# EAGLE design testduino (EAGLE 6.5.0)
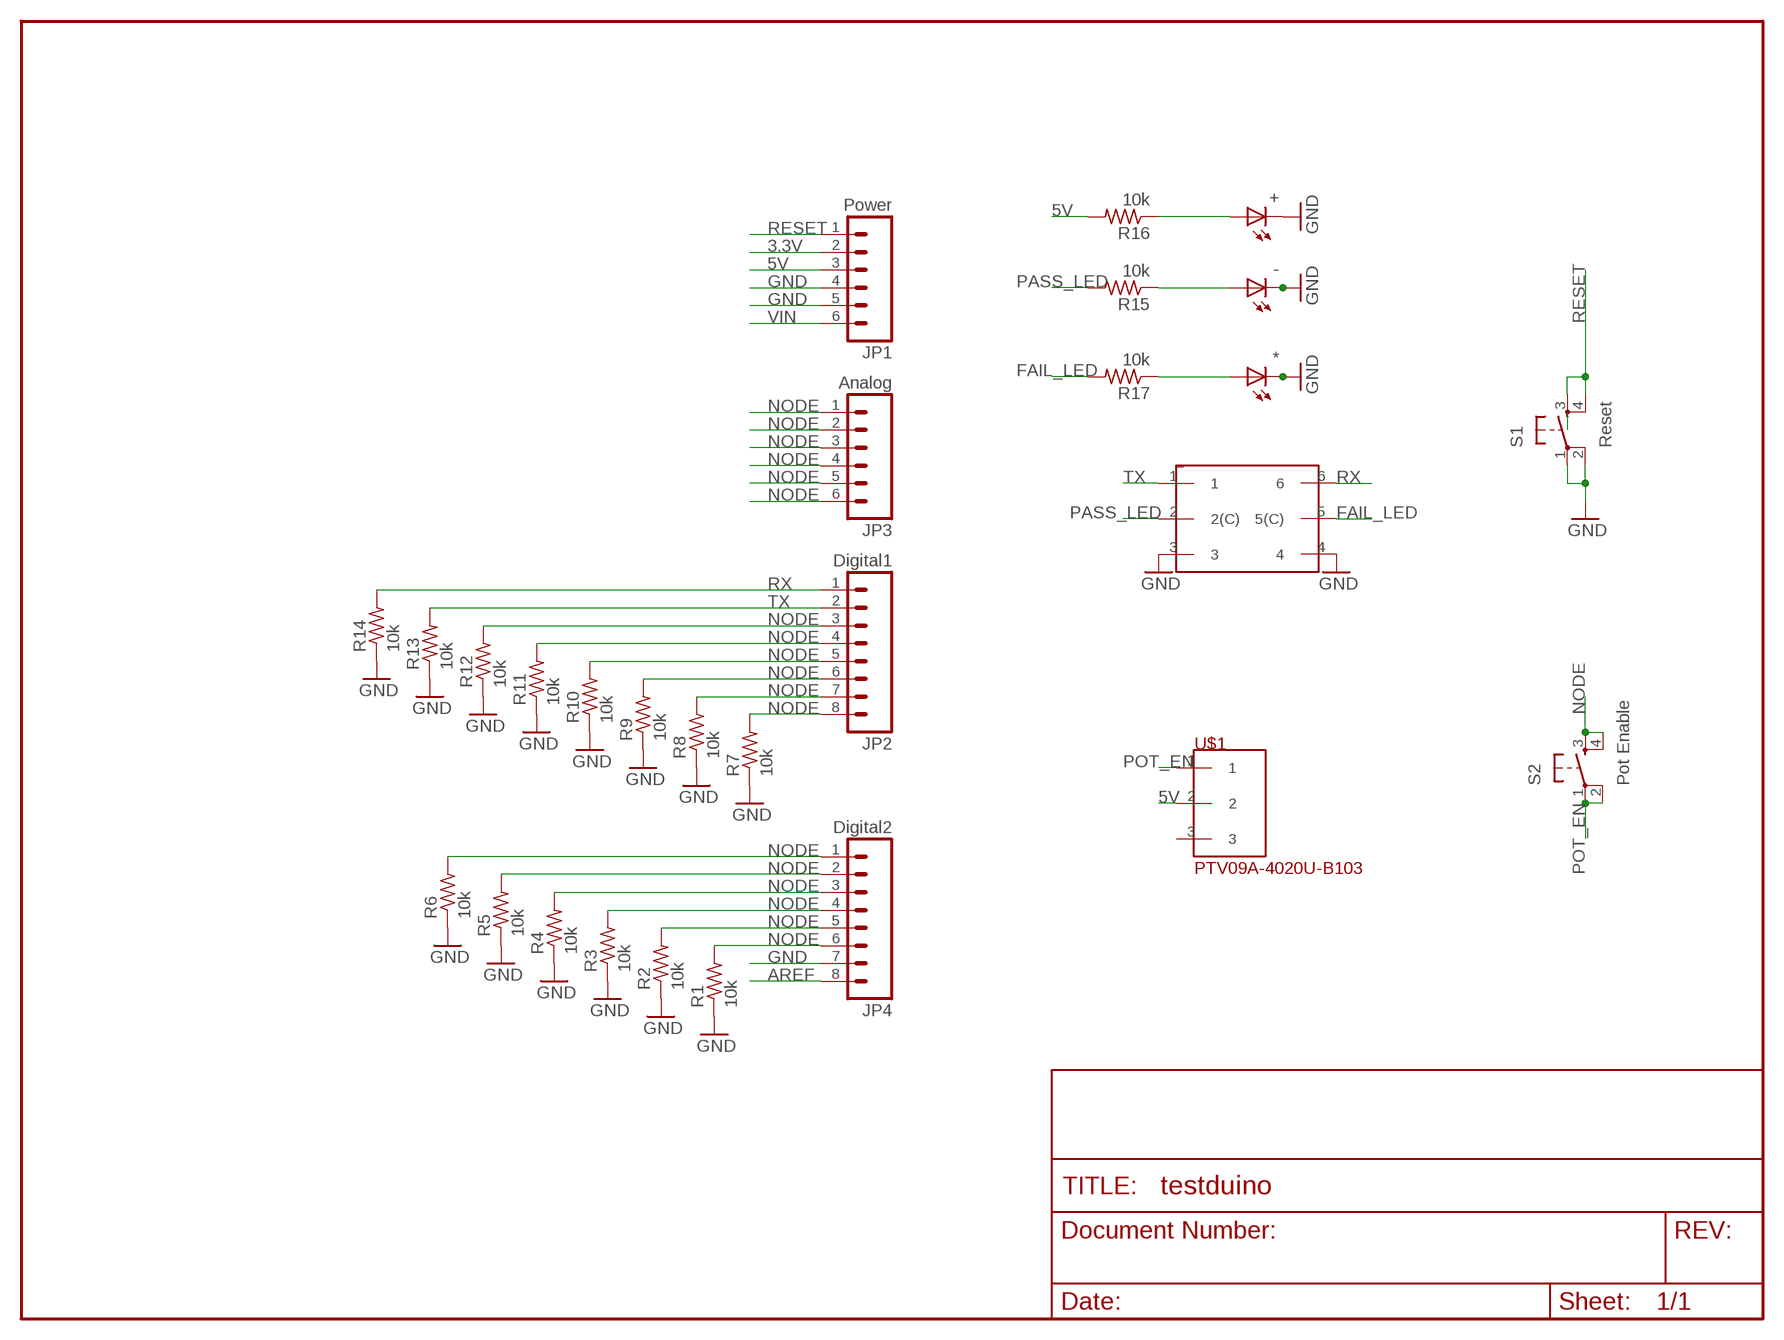
[diagram p0: schematic, sheet 1]

## Parts
*  LEDSML0805  [SML0805]
+  LEDSML0805  [SML0805]
-  LEDSML0805  [SML0805]
_  JS202011SCQN  [JS202011SCQN]
JP1  Power  M06SIP  [1X06]
JP2  Digital1  M08  [1X08]
JP3  Analog  M06SIP  [1X06]
JP4  Digital2  M08  [1X08]
R1  10k  R-US_R0402  [R0402]
R2  10k  R-US_R0402  [R0402]
R3  10k  R-US_R0402  [R0402]
R4  10k  R-US_R0402  [R0402]
R5  10k  R-US_R0402  [R0402]
R6  10k  R-US_R0402  [R0402]
R7  10k  R-US_R0402  [R0402]
R8  10k  R-US_R0402  [R0402]
R9  10k  R-US_R0402  [R0402]
R10  10k  R-US_R0402  [R0402]
R11  10k  R-US_R0402  [R0402]
R12  10k  R-US_R0402  [R0402]
R13  10k  R-US_R0402  [R0402]
R14  10k  R-US_R0402  [R0402]
R15  10k  R-US_R0402  [R0402]
R16  10k  R-US_R0402  [R0402]
R17  10k  R-US_R0402  [R0402]
S1  Reset  TAC_SWITCHPTH  [TACTILE-PTH]
S2  Pot Enable  TAC_SWITCHPTH  [TACTILE-PTH]
U$1  PTV09A-4020U-B103  [PTV09A-1]

## Nets
3.3V: JP1.2
5V [power]: JP1.3 R16.2 U$1.2
AREF: JP4.8
FAIL_LED: _.5(5(C)) R17.2
GND: *.C +.C -.C _.3 _.4 JP1.4 JP1.5 JP4.7 R1.1 R2.1 R3.1 R4.1 R5.1 R6.1 R7.1 R8.1 R9.1 R10.1 R11.1 R12.1 R13.1 R14.1 S1.1 S1.2
N$1: -.A R15.1
N$2: +.A R16.1
N$3: *.A R17.1
NODE: JP2.3 JP2.4 JP2.5 JP2.6 JP2.7 JP2.8 JP3.1 JP3.2 JP3.3 JP3.4 JP3.5 JP3.6 JP4.1 JP4.2 JP4.3 JP4.4 JP4.5 JP4.6 R1.2 R2.2 R3.2 R4.2 R5.2 R6.2 R7.2 R8.2 R9.2 R10.2 R11.2 R12.2 S2.3 S2.4
PASS_LED: _.2(2(C)) R15.2
POT_EN: S2.1 S2.2 U$1.1
RESET: JP1.1 S1.3 S1.4
RX: _.6 JP2.1 R14.2
TX: _.1 JP2.2 R13.2
VIN [power]: JP1.6
Unconnected: U$1.3

## Library data of the parts
* + - = led:LED: LED OSRAM: - CHIPLED LG R971, LG N971, LY N971, LG Q971, LY Q971, LO R971, LY R971 LH N974, LH R974 LS Q976, LO Q976, LY Q976 LO Q996 - Hyper CHIPLED LW Q18S LB Q993, LB Q99A, LB R99A - SideLED LS A670, LO A670, LY A670, LG A670, LP A670 LB A673, LV A673, LT A673, LW A673 LH A674 LY A675 LS A676, LA A676, LO A676, LY A676, LW A676 LS A679, LY A679, LG A679 - Hyper Micro SIDELED® LS Y876, LA Y876, LO Y876, LY Y876 LT Y87S - SmartLED LW L88C, LW L88S LB L89C, LB L89S, LG L890 LS L89K, LO L89K, LY L89K LS L896, LA L896, LO L896, LY L896 - TOPLED LS T670, LO T670, LY T670, LG T670, LP T670 LSG T670, LSP T670, LSY T670, LOP T670, LYG T670 LG T671, LOG T671, LSG T671 LB T673, LV T673, LT T673, LW T673 LH T674 LS T676, LA T676, LO T676, LY T676, LB T676, LH T676, LSB T676, LW T676 LB T67C, LV T67C, LT T67C, LS T67K, LO T67K, LY T67K, LW E67C LS E67B, LA E67B, LO E67B, LY E67B, LB E67C, LV E67C, LT E67C LW T67C LS T679, LY T679, LG T679 LS T770, LO T770, LY T770, LG T770, LP T770 LB T773, LV T773, LT T773, LW T773 LH T774 LS E675, LA E675, LY E675, LS T675 LS T776, LA T776, LO T776, LY T776, LB T776 LHGB T686 LT T68C, LB T68C - Hyper Mini TOPLED® LB M676 - Mini TOPLED Santana® LG M470 LS M47K, LO M47K, LY M47K Source: http://www.osram.convergy.de LUXEON: - LUMILED® LXK2-PW12-R00, LXK2-PW12-S00, LXK2-PW14-U00, LXK2-PW14-V00 LXK2-PM12-R00, LXK2-PM12-S00, LXK2-PM14-U00 LXK2-PE12-Q00, LXK2-PE12-R00, LXK2-PE12-S00, LXK2-PE14-T00, LXK2-PE14-U00 LXK2-PB12-K00, LXK2-PB12-L00, LXK2-PB12-M00, LXK2-PB14-N00, LXK2-PB14-P00, LXK2-PB14-Q00 LXK2-PR12-L00, LXK2-PR12-M00, LXK2-PR14-Q00, LXK2-PR14-R00 LXK2-PD12-Q00, LXK2-PD12-R00, LXK2-PD12-S00 LXK2-PH12-R00, LXK2-PH12-S00 LXK2-PL12-P00, LXK2-PL12-Q00, LXK2-PL12-R00 Source: www.luxeon.com KINGBRIGHT: KA-3528ASYC Source: www.kingbright.com
_ = JS202011SCQN:JS202011SCQN
JP1 JP3 = SparkFun:M06: Header 6 Standard 6-pin 0.1" header. Use with straight break away headers (SKU : PRT-00116), right angle break away headers (PRT-00553), swiss pins (PRT-00743), machine pins (PRT-00117), and female headers (PRT-00115). Molex polarized connector foot print use with SKU : PRT-08094 with associated crimp pins and housings. NOTES ON THE VARIANTS LOCK and LOCK_LONGPADS... This footprint was designed to help hold the alignment of a through-hole component (i.e. 6-pin header) while soldering it into place. You may notice that each hole has been shifted either up or down by 0.005 of an inch from it's more standard position (which is a perfectly straight line). This slight alteration caused the pins (the squares in the middle) to touch the edges of the holes. Because they are alternating, it causes a "brace" to hold the component in place. 0.005 has proven to be the perfect amount of "off-center" position when using our standard breakaway headers. Although looks a little odd when you look at the bare footprint, once you have a header in there, the alteration is very hard to notice. Also, if you push a header all the way into place, it is covered up entirely on the bottom side. This idea of altering the position of holes to aid alignment will be further integrated into the Sparkfun Library for other footprints. It can help hold any component with 3 or more connection pins.
JP2 JP4 = SparkFun:M08: Header 8 Standard 8-pin 0.1" header. Use with straight break away headers (SKU : PRT-00116), right angle break away headers (PRT-00553), swiss pins (PRT-00743), machine pins (PRT-00117), and female headers (PRT-00115).
R1-R17 = rcl:R-US_: RESISTOR, American symbol
S1 S2 = SparkFun:TAC_SWITCH: Momentary Switch Button commonly used for reset or general input. Spark Fun Electronics SKU : COM-00097
U$1 = PTV09A-4020U-B103:PTV09A-4020U-B103

## Net classes
1 power: width 0.254 mm

## Board
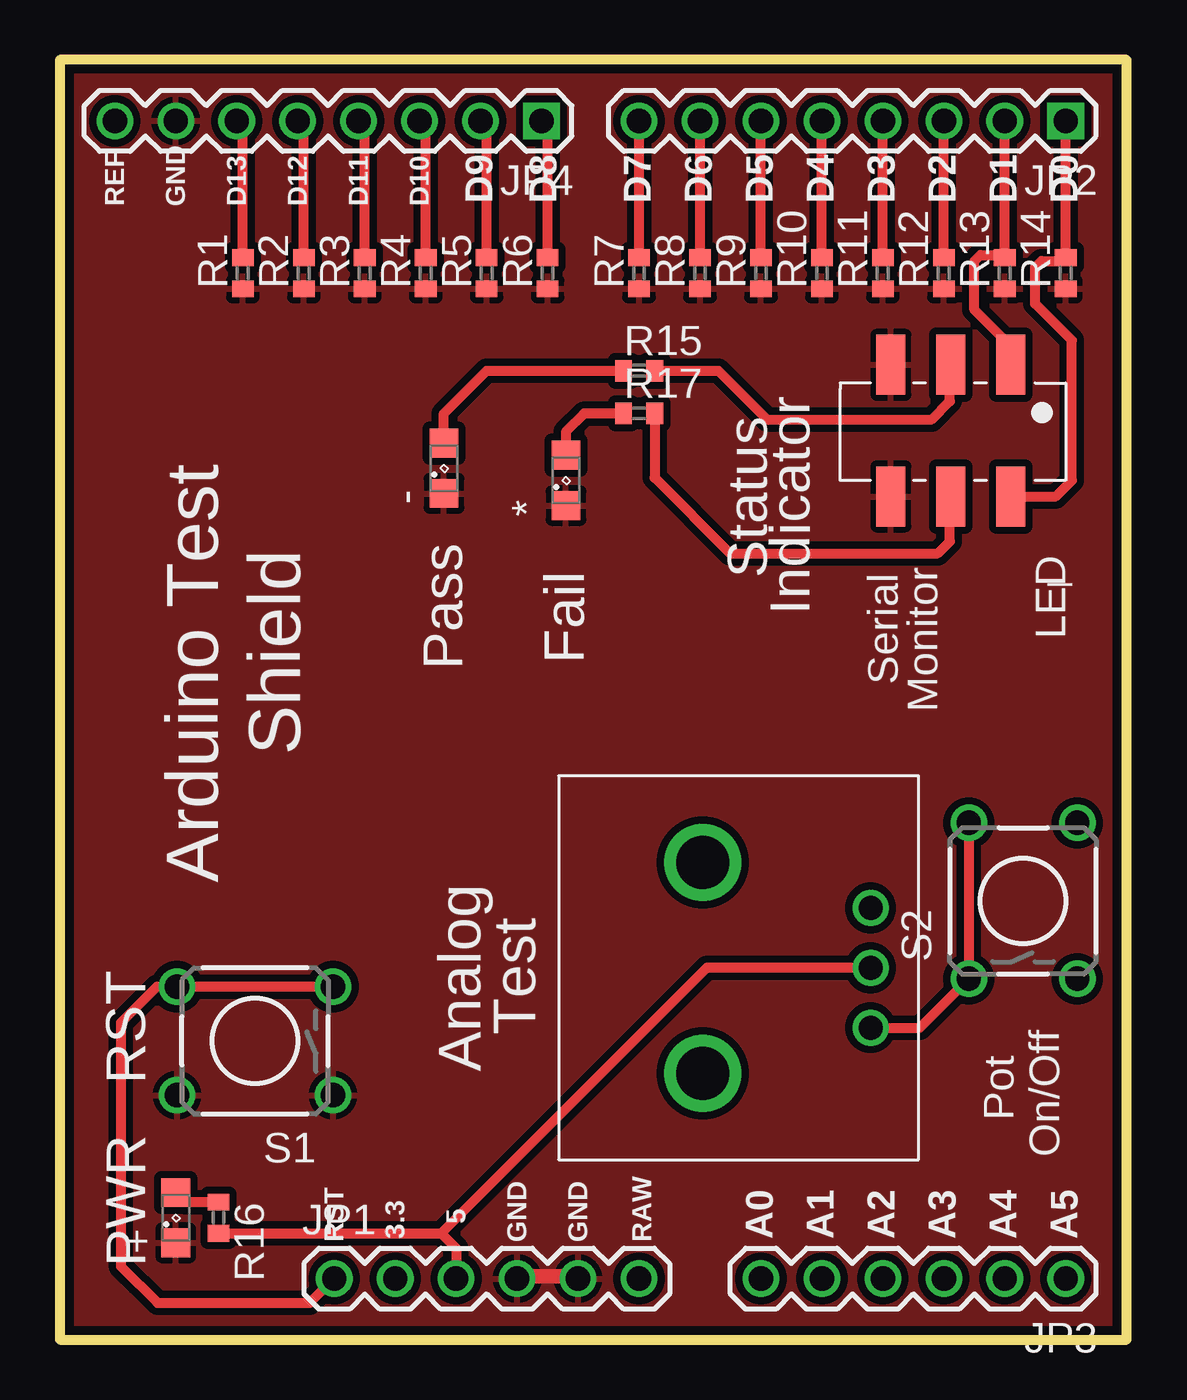
[diagram p1: board, top side]
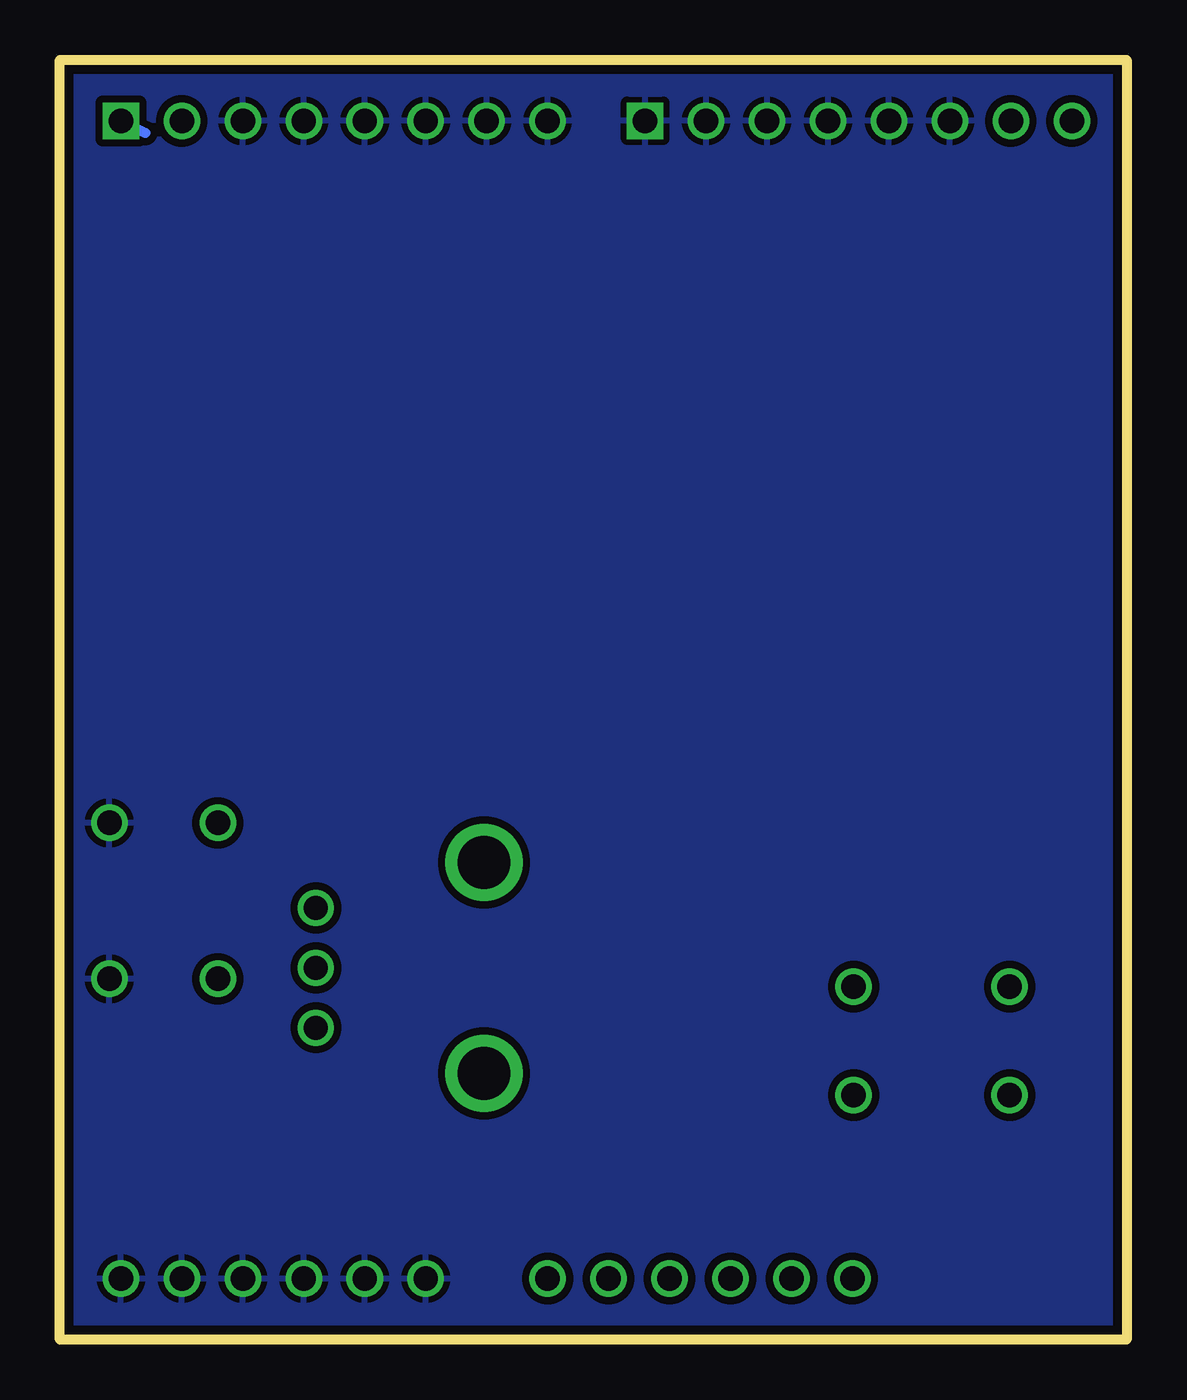
[diagram p2: board, bottom side, seen from below]

Size 44.45 x 53.34 mm. Coordinates in mm from the lower left corner, seen from the top.
Outline: 0,0 44.45,0 44.45,53.34 0,53.34 0,0
Copper layers (1*16): Top 0.0356mm / dielectric 1.5011mm / Bottom 0.0356mm
Design rules "LaenPCBOrder": minimum track width 6mil, minimum drill 13mil, track to track 6mil, track to pad 6mil, pad to pad 6mil, via to via 6mil, smd to smd 6mil, copper to edge 15mil, drill to drill 6mil, minimum pad ring 7mil, minimum via ring 7mil, stop-mask expansion 3mil, vias tented up to drill 0mil, thermal gap 10mil

### Footprints (pad centres in the part's own frame; a part is rotated, then mirrored left to right if it is on the bottom)
SML0805 = smd 1.2 x 1.2: A 1.05,0; C -1.05,0
JS202011SCQN = smd 1.2 x 2.5: 1 0,0; 2 2.5,0; 3 5,0; 4 5,5.5; 5 2.5,5.5; 6 0,5.5
1X06 = drill 1.016: 1 0,0; 2 2.54,0; 3 5.08,0; 4 7.62,0; 5 10.16,0; 6 12.7,0
1X08 = drill 1.016 square: 1 0,0 | drill 1.016: 2 2.54,0; 3 5.08,0; 4 7.62,0; 5 10.16,0; 6 12.7,0; 7 15.24,0; 8 17.78,0
R0402 = smd 0.7 x 0.9: 1 -0.65,0; 2 0.65,0
TACTILE-PTH = drill 1.016: 1 -3.251,2.261; 2 3.251,2.261; 3 -3.251,-2.261; 4 3.251,-2.261
PTV09A-1 = drill 1: 1 -2.5,0; 2 0,0; 3 2.5,0 | drill 2.2: P$4 -4.4,7; P$5 4.4,7

### Placement (x,y rotation side)
*  21.08,35.81 90 top
+  4.83,5.08 90 top
-  16,36.32 90 top
_  39.62,40.64 180 top
JP1  11.43,2.54 0 top
JP2  41.91,50.8 180 top
JP3  41.91,2.54 180 top
JP4  20.07,50.8 180 top
R1  7.62,44.45 90 top
R2  10.16,44.45 90 top
R3  12.7,44.45 90 top
R4  15.24,44.45 90 top
R5  17.78,44.45 90 top
R6  20.32,44.45 90 top
R7  24.13,44.45 90 top
R8  26.67,44.45 90 top
R9  29.21,44.45 90 top
R10  31.75,44.45 90 top
R11  34.29,44.45 90 top
R12  36.83,44.45 90 top
R13  39.37,44.45 90 top
R14  41.91,44.45 90 top
R15  24.13,40.39 0 top
R16  6.6,5.08 270 top
R17  24.13,38.61 0 top
S1  8.13,12.45 180 top
S2  40.13,18.29 90 top
U$1  33.78,15.49 90 top

### Tracks (layer width: path | path; a pad name or v marks a point on that pad's centre or on a via)
5V
  Top 0.406: R16.2 15.89,4.43 | 15.89,4.43 16.51,3.81 JP1.3 | U$1.2 26.95,15.49 15.89,4.43
FAIL_LED
  Top 0.406: R17.2 24.78,35.93 27.94,32.77 36.58,32.77 37.08,33.27 37.08,35.1 _.5
GND
  Top 0.61: JP1.4 19.66,2.64 20.88,2.64 JP1.5
  pour Top (isolate 0.305, rank 2): 52.07,53.34 52.07,0 0,0 0,53.34
N$1
  Top 0.406: -.A 16,38.61 17.78,40.39 R15.1
N$2
  Top 0.406: R16.1 5.23,5.73 +.A
N$3
  Top 0.406: R17.1 21.84,38.61 21.08,37.85 *.A
NODE
  Top 0.406: R7.2 JP2.8 | R8.2 JP2.7 | R9.2 JP2.6 | R10.2 JP2.5 | R11.2 JP2.4 | R12.2 JP2.3 | R6.2 20.32,50.8 JP4.1 | R5.2 17.78,50.8 JP4.2 | R4.2 15.24,50.8 JP4.3 | R3.2 12.7,50.8 JP4.4 | R2.2 10.16,50.8 JP4.5 | R1.2 7.62,50.8 JP4.6
  pour Bottom (isolate 0.305, rank 2): 48.26,53.34 48.26,0 0,0 0,53.34
PASS_LED
  Top 0.406: R15.2 27.43,40.39 29.46,38.35 36.32,38.35 37.08,39.12 37.08,40.6 _.2
POT_EN
  Top 0.406: S2.2 S2.1 35.83,12.99 U$1.1
RESET
  Top 0.406: S1.3 S1.4 4.04,14.71 2.54,13.21 2.54,3.05 4.06,1.52 10.41,1.52 JP1.1
RX
  Top 0.406: JP2.1 R14.2 41.77,44.96 40.89,44.96 40.64,44.7 40.64,43.18 42.16,41.66 42.16,35.81 41.49,35.14 _.6
  Bottom 0.406: 40.89,50.29 JP2.1
TX
  Top 0.406: JP2.2 R13.2 39.26,45.21 38.35,45.21 38.1,44.96 38.1,42.93 39.62,41.4 _.1

### Text on the board
tPlace: REF | GND | D13 | D12 | D11 | D10 | D9 | D8 | D7 | D6 | D5 | D4 | D3 | D2 | D1 | D0 | Status | Indicator | LED | Pass | Fail | Serial | Monitor | Shield | Arduino Test | Test | RST | Analog | Pot | On/Off | 5 | RST | 3.3 | GND | GND | RAW | A0 | A1 | A2 | A3 | A4 | A5 | PWR